# Altium schematic sheet Page09 eMMC_QSPI.SchDoc
size 386 x 246 mm
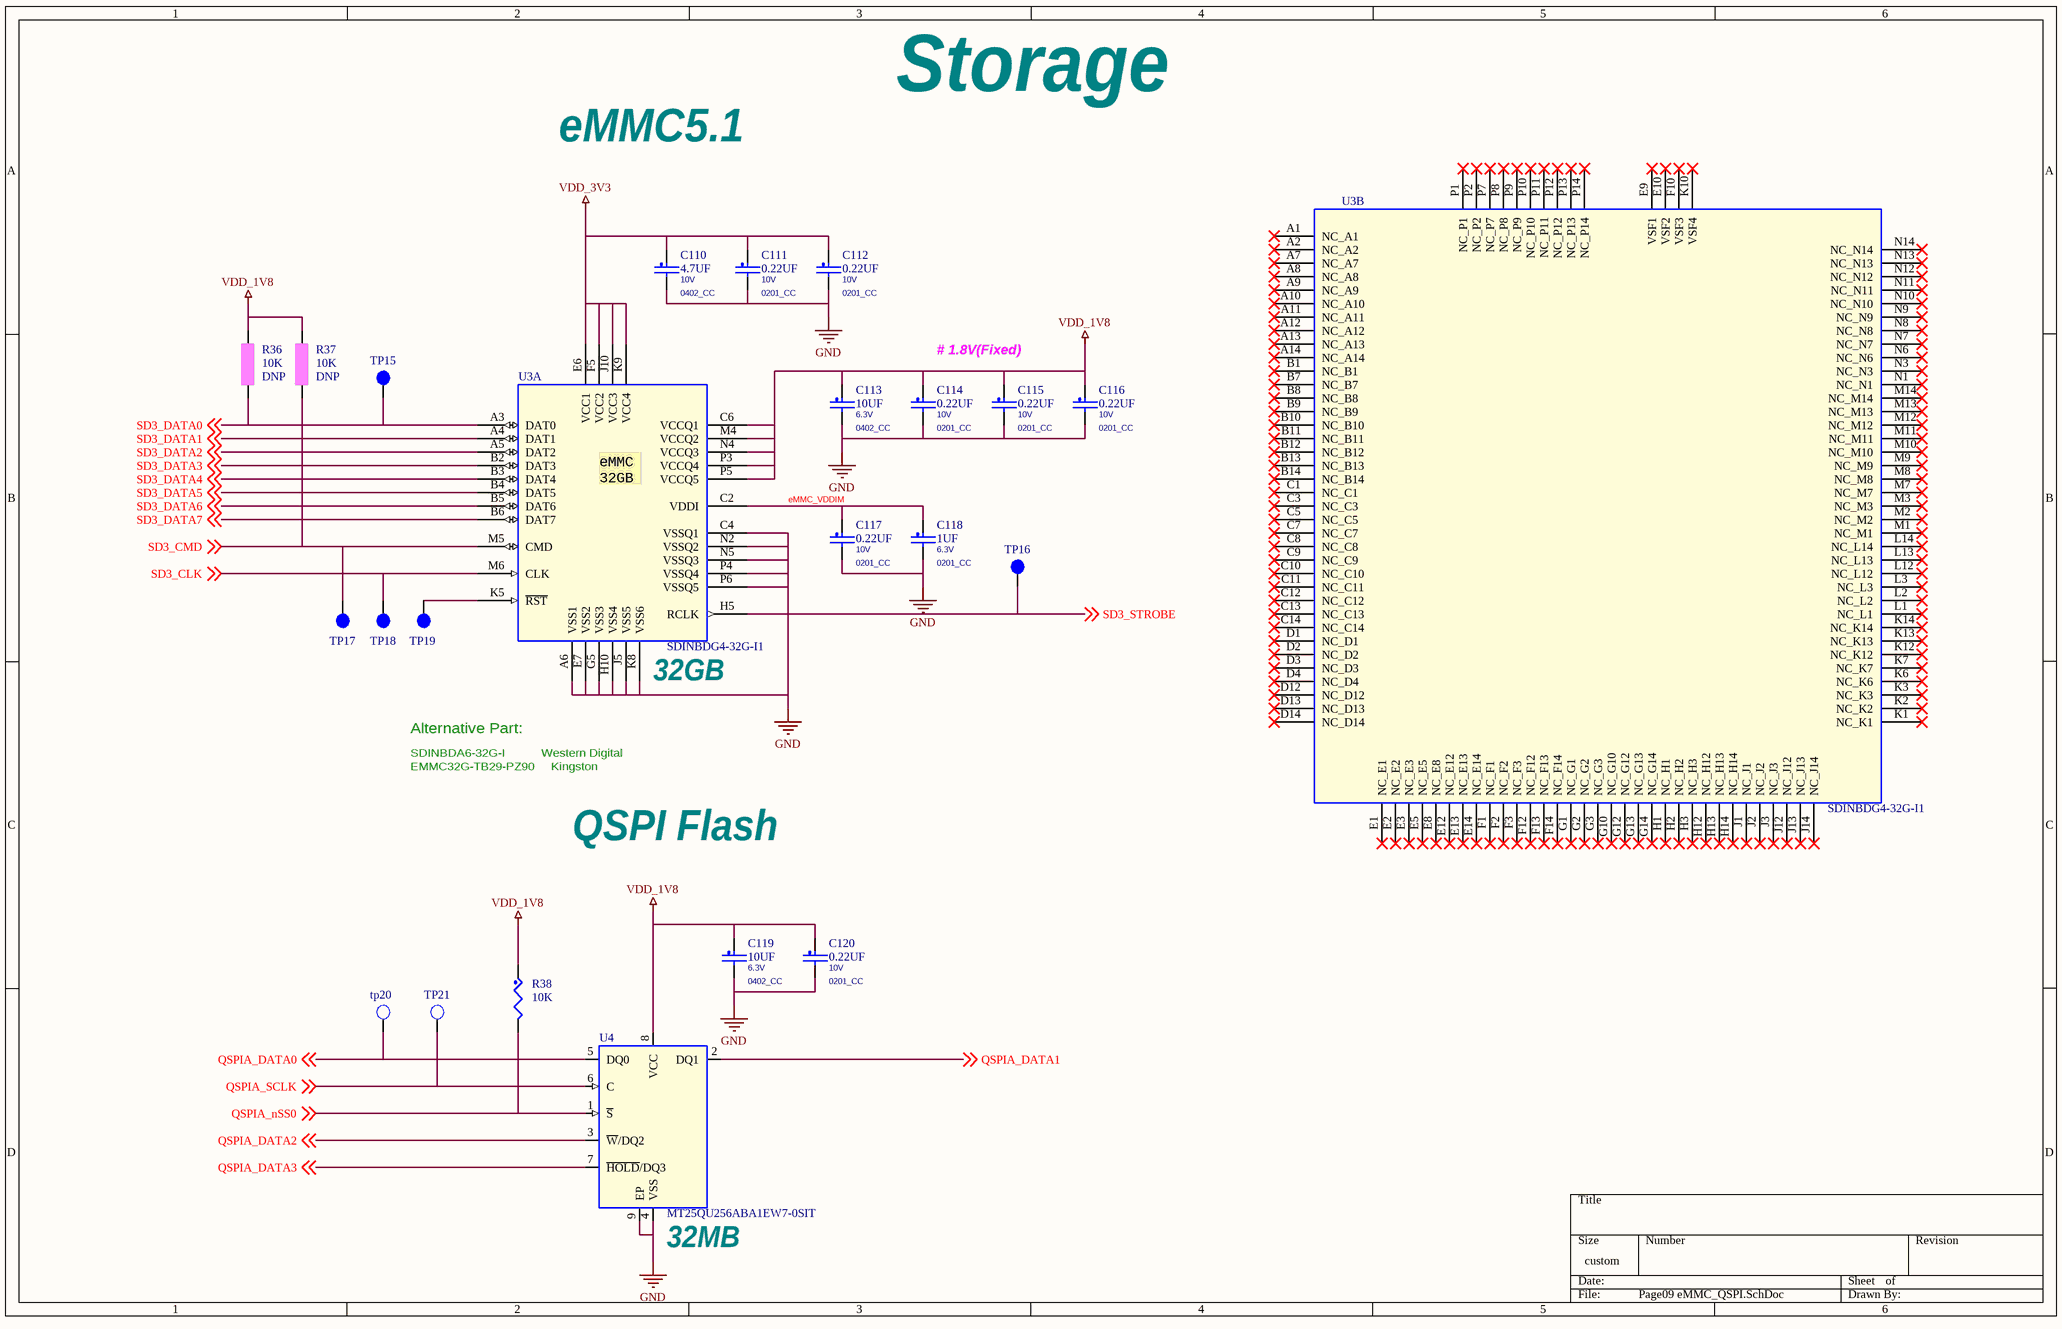
[diagram p0: Page09 eMMC_QSPI.SchDoc]

## Parts
C110  4.7UF  VOLTAGE: 10V  [0402_CC]
C111  0.22UF  VOLTAGE: 10V  [0201_CC]
C112  0.22UF  VOLTAGE: 10V  [0201_CC]
C113  10UF  VOLTAGE: 6.3V  [0402_CC]
C114  0.22UF  VOLTAGE: 10V  [0201_CC]
C115  0.22UF  VOLTAGE: 10V  [0201_CC]
C116  0.22UF  VOLTAGE: 10V  [0201_CC]
C117  0.22UF  VOLTAGE: 10V  [0201_CC]
C118  1UF  VOLTAGE: 6.3V  [0201_CC]
C119  10UF  VOLTAGE: 6.3V  [0402_CC]
C120  0.22UF  VOLTAGE: 10V  [0201_CC]
R36  10K  ASSY_OPT: DNP  [0201_CC]
R37  10K  ASSY_OPT: DNP  [0201_CC]
R38  10K  [0402_CC]
TP15  tpad_020  [tpad_020]  (value not drawn)
TP16  tpad_020  [tpad_020]  (value not drawn)
TP17  tpad_020  [tpad_020]  (value not drawn)
TP18  tpad_020  [tpad_020]  (value not drawn)
TP19  TPAD_015  [TPAD_015]  (value not drawn)
tp20  TP_35MIL  [testpoint_35mil]  (value not drawn)
TP21  TP_35MIL  [testpoint_35mil]  (value not drawn)
U3  SDINBDG4-32G-I1  [fbga153_0p5_11p5x13]  (parts A,B of 2)
U4  MT25QU256ABA1EW7-0SIT  [dfn8_1p27_6x5mm_3p1]

## Nets
GND: C110.2 C111.2 C112.2 C113.2 C114.2 C115.2 C116.2 C117.2 C118.2 C119.2 C120.2 U3.A6(VSS1) U3.C4(VSSQ1) U3.E7(VSS2) U3.G5(VSS3) U3.H10(VSS4) U3.J5(VSS5) U3.K8(VSS6) U3.N2(VSSQ2) U3.N5(VSSQ3) U3.P4(VSSQ4) U3.P6(VSSQ5) U4.4(VSS) U4.9(EP)
VDD_1V8: C113.1 C114.1 C115.1 C116.1 C119.1 C120.1 R36.1 R37.1 R38.1 U3.C6(VCCQ1) U3.M4(VCCQ2) U3.N4(VCCQ3) U3.P3(VCCQ4) U3.P5(VCCQ5) U4.8(VCC)
VDD_3V3: C110.1 C111.1 C112.1 U3.E6(VCC1) U3.F5(VCC2) U3.J10(VCC3) U3.K9(VCC4)
eMMC_VDDIM: C117.1 C118.1 U3.C2(VDDI)
QSPIA_DATA0: tp20.1(TP) U4.5(DQ0) ; off-sheet QSPIA_DATA0
QSPIA_DATA1: U4.2(DQ1) ; off-sheet QSPIA_DATA1
QSPIA_DATA2: U4.3(~{W}/DQ2) ; off-sheet QSPIA_DATA2
QSPIA_DATA3: U4.7(~{HOLD}/DQ3) ; off-sheet QSPIA_DATA3
QSPIA_nSS0: R38.2 U4.1(~{S}) ; off-sheet QSPIA_nSS0
QSPIA_SCLK: TP21.1(TP) U4.6(C) ; off-sheet QSPIA_SCLK
SD3_CLK: TP18.1(Pin1) U3.M6(CLK) ; off-sheet SD3_CLK
SD3_CMD: R37.2 TP17.1(Pin1) U3.M5(CMD) ; off-sheet SD3_CMD
SD3_DATA0: R36.2 TP15.1(Pin1) U3.A3(DAT0) ; off-sheet SD3_DATA0
SD3_DATA1: U3.A4(DAT1) ; off-sheet SD3_DATA1
SD3_DATA2: U3.A5(DAT2) ; off-sheet SD3_DATA2
SD3_DATA3: U3.B2(DAT3) ; off-sheet SD3_DATA3
SD3_DATA4: U3.B3(DAT4) ; off-sheet SD3_DATA4
SD3_DATA5: U3.B4(DAT5) ; off-sheet SD3_DATA5
SD3_DATA6: U3.B5(DAT6) ; off-sheet SD3_DATA6
SD3_DATA7: U3.B6(DAT7) ; off-sheet SD3_DATA7
SD3_STROBE: TP16.1(Pin1) U3.H5(RCLK) ; off-sheet SD3_STROBE
NetTP19_1: TP19.1(Pin1) U3.K5(~{RST})

Not connected (* = marked no-connect by the designer): U3 A1(NC_A1)* A2(NC_A2)* A7(NC_A7)* A8(NC_A8)* A9(NC_A9)* A10(NC_A10)* A11(NC_A11)* A12(NC_A12)* A13(NC_A13)* A14(NC_A14)* B1(NC_B1)* B7(NC_B7)* B8(NC_B8)* B9(NC_B9)* B10(NC_B10)* B11(NC_B11)* B12(NC_B12)* B13(NC_B13)* B14(NC_B14)* C1(NC_C1)* C3(NC_C3)* C5(NC_C5)* C7(NC_C7)* C8(NC_C8)* C9(NC_C9)* C10(NC_C10)* C11(NC_C11)* C12(NC_C12)* C13(NC_C13)* C14(NC_C14)* D1(NC_D1)* D2(NC_D2)* D3(NC_D3)* D4(NC_D4)* D12(NC_D12)* D13(NC_D13)* D14(NC_D14)* E1(NC_E1)* E2(NC_E2)* E3(NC_E3)* E5(NC_E5)* E8(NC_E8)* E9(VSF1)* E10(VSF2)* E12(NC_E12)* E13(NC_E13)* E14(NC_E14)* F1(NC_F1)* F2(NC_F2)* F3(NC_F3)* F10(VSF3)* F12(NC_F12)* F13(NC_F13)* F14(NC_F14)* G1(NC_G1)* G2(NC_G2)* G3(NC_G3)* G10(NC_G10)* G12(NC_G12)* G13(NC_G13)* G14(NC_G14)* H1(NC_H1)* H2(NC_H2)* H3(NC_H3)* H12(NC_H12)* H13(NC_H13)* H14(NC_H14)* J1(NC_J1)* J2(NC_J2)* J3(NC_J3)* J12(NC_J12)* J13(NC_J13)* J14(NC_J14)* K1(NC_K1)* K2(NC_K2)* K3(NC_K3)* K6(NC_K6)* K7(NC_K7)* K10(VSF4)* K12(NC_K12)* K13(NC_K13)* K14(NC_K14)* L1(NC_L1)* L2(NC_L2)* L3(NC_L3)* L12(NC_L12)* L13(NC_L13)* L14(NC_L14)* M1(NC_M1)* M2(NC_M2)* M3(NC_M3)* M7(NC_M7)* M8(NC_M8)* M9(NC_M9)* M10(NC_M10)* M11(NC_M11)* M12(NC_M12)* M13(NC_M13)* M14(NC_M14)* N1(NC_N1)* N3(NC_N3)* N6(NC_N6)* N7(NC_N7)* N8(NC_N8)* N9(NC_N9)* N10(NC_N10)* N11(NC_N11)* N12(NC_N12)* N13(NC_N13)* N14(NC_N14)* P1(NC_P1)* P2(NC_P2)* P7(NC_P7)* P8(NC_P8)* P9(NC_P9)* P10(NC_P10)* P11(NC_P11)* P12(NC_P12)* P13(NC_P13)* P14(NC_P14)*

## Notes on the sheet
- Storage
- eMMC5.1
- # 1.8V(Fixed)
- Alternative Part:
- (near U3) 32GB
- SDINBDA6-32G-I           Western Digital
- EMMC32G-TB29-PZ90     Kingston
- QSPI Flash
- (near U4) 32MB
- (in symbol SDINBDG4-16G_VFBGA_153P, part A) eMMC / 32GB

## Library data of the parts
C110 = CAP_NP: CAP CER 4.7uF 10V 10% X5R 0402; CLASS: DISCRETE; FPLIST: CC0402_25,CC0402_HD,0402_CC; CAD_APPROVED: Yes; MFG_PN01: CL05A475KP5NRNC; MFG_NAME01: Samsung Electro Mechanics; AGILE_PN: 150-80044; HEIGHT: 0.65MM; ROHS: Yes; Tolerance: 10%; PCB Footprint: 0402_CC
C111 C114-C116 = CAP_NP: CAP CER 0.22UF 10V 20% X5R 0201; CLASS: DISCRETE; FPLIST: CC0201,CC0201_HD,0201_CC; CAD_APPROVED: Yes; MFG_PN01: LMK063BJ224MP-F; MFG_NAME01: Taiyo Yuden; AGILE_PN: 150-78815; HEIGHT: 0.33MM; ROHS: Yes; Tolerance: 20%; PCB Footprint: 0201_CC
C112 C117 C120 = CAP_NP: CAP CER 0.22UF 10V 20% X5R 0201; CLASS: DISCRETE; AGILE_PN: 150-78815; MFG_NAME01: Taiyo Yuden; MFG_PN01: LMK063BJ224MP-F; CAD_APPROVED: Yes; FPLIST: CC0201,CC0201_HD,0201_CC; Tolerance: 20%; ROHS: Yes; HEIGHT: 0.33MM; PCB Footprint: 0201_CC
C113 = CAP_NP: CAP CER 10UF 6.3V 20% X5R 0402; CLASS: DISCRETE; FPLIST: CC0402_25,CC0402_HD,0402_CC; CAD_APPROVED: Yes; MFG_PN01: CL05A106MQ5NUNC; MFG_NAME01: SAMSUNG ELECTRO MECHANICS; AGILE_PN: 150-79163; HEIGHT: 0.65 MM; ROHS: Yes; Tolerance: 20%; PCB Footprint: 0402_CC
C118 = CAP_NP: CAP CER 1uF 6.3V 20% X5R 0201; CLASS: DISCRETE; FPLIST: CC0201,CC0201_HD,0201_CC,0201_CC_012SM_NSP; CAD_APPROVED: Yes; MFG_PN01: 02016D105MAT2A; MFG_NAME01: AVX; AGILE_PN: 150-79407; HEIGHT: 0.35MM; ROHS: Yes; Tolerance: 20%; PCB Footprint: 0201_CC; Package Size: 0201; Package Type: 7¡± reel
C119 = CAP_NP: CAP CER 10UF 6.3V 20% X5R 0402; CLASS: DISCRETE; AGILE_PN: 150-79163; MFG_NAME01: SAMSUNG ELECTRO MECHANICS; MFG_PN01: CL05A106MQ5NUNC; CAD_APPROVED: Yes; FPLIST: CC0402_25,CC0402_HD,0402_CC; Tolerance: 20%; ROHS: Yes; HEIGHT: 0.65 MM; PCB Footprint: 0402_CC
R36 R37 = RES: RES MF 10K 1/20W 5% 0201; CLASS: DISCRETE; AGILE_PN: 470-79719; MFG_NAME01: RALEC ELECTRONIC CORP; MFG_PN01: RTT01103JTH; CAD_APPROVED: Yes; FPLIST: RC0201,0201_CC; PCB Footprint: 0201_CC; Tolerance: 5%; ROHS: Yes; HEIGHT: 0.26 MM
R38 = RES: RES MF 10K 1/16W 5% 0402; CLASS: DISCRETE; FPLIST: RC0402_25,RC0402_HD,0402_CC; CAD_APPROVED: Yes; MFG_PN01: CRCW040210K0JNED; MFG_NAME01: VISHAY INTERTECHNOLOGY; AGILE_PN: 470-75557; PCB Footprint: 0402_CC; ROHS: Yes; Tolerance: 5%; HEIGHT: 0.4 MM
TP15 = TESTLOOP: TEST POINT PAD 0.5MM DIA SMT, NO PART TO ORDER; ASSY_OPT: DNP; CLASS: IO; AGILE_PN: 211-77484; CAD_APPROVED: Yes; PCB Footprint: tpad_020; ROHS: Yes; HEIGHT: 0.1MM
TP16-TP18 = TESTLOOP: TEST POINT PAD 0.5MM DIA SMT, NO PART TO ORDER; ASSY_OPT: DNP; CLASS: IO; CAD_APPROVED: Yes; AGILE_PN: 211-77484; PCB Footprint: tpad_020; HEIGHT: 0.1MM; ROHS: Yes
TP19 = TESTLOOP: TEST POINT PAD 15MIL DIA SMT, NO PART TO ORDER; ASSY_OPT: DNP; CLASS: IO; CAD_APPROVED: Yes; MFG_PN01: NOTACOMPONENT; AGILE_PN: 211-76645; HEIGHT: 0.1MM; ROHS: Yes; MFG_NAME01: NOTACOMPONENT; PCB Footprint: TPAD_015
tp20 TP21 = T POINT R: TEST POINT PAD .035 SMT, no part to order; CLASS: IC; ASSY_OPT: DNP; CAD_APPROVED: Yes; AGILE_PN: 510-75618; PCB Footprint: testpoint_35mil; HEIGHT: 0.1MM; ROHS: Yes
U3 = SDINBDG4-16G_VFBGA_153P: IC MEM NAND FLASH 32GB eMMC 5.1 CTLR 2.7-3.6V FBGA153; AGILE_PN: 342-00840; Supply Voltage: 2.7 V to 3.6 V; Temp Range: -25¡ãC to +85¡ãC; MFG_NAME01: SanDisk; CLASS: IC; Package Size: 11.5 mm x 13 mm x 1 mm; HEIGHT: 1MM; ROHS: YES; VOLTAGE: 2.7-3.6V; MFG_PN01: SDINBDG4-32G-I1; PCB Footprint: fbga153_0p5_11p5x13
U4 = MT25QL256ABA1EW9_9P: IC MEM FLASH SERIAL NOR 256MBIT 166MHZ 1.7-2V WPDFN8; AGILE_PN: 334-77688; MFG_NAME01: MICRON; CAD_APPROVED: Yes; CLASS: IC; PCB Footprint: dfn8_1p27_6x5mm_3p1; MFG_PN01: MT25QU256ABA1EW7-0SIT; ROHS: Yes; HEIGHT: 0.8 MM; VOLTAGE: 1.7-2V